# Altium schematic sheet Sheet2.SchDoc
size A4; SheetNumber: 2; SheetTotal: 3
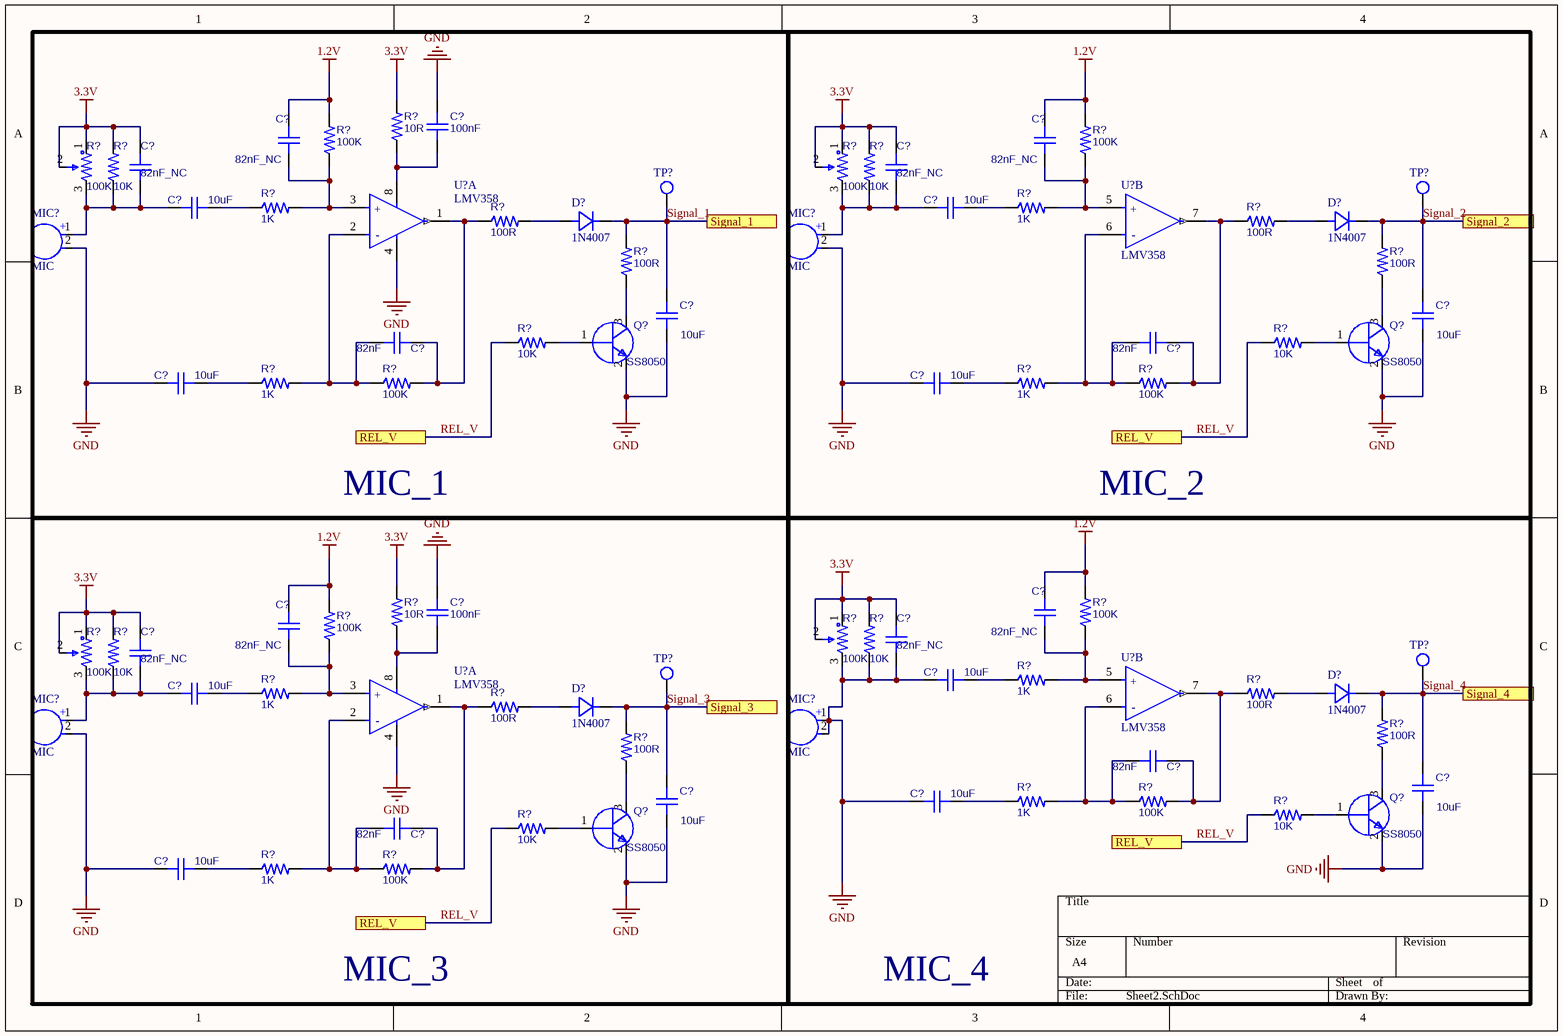
[diagram p0: Sheet2.SchDoc]

## Parts
(Parts that share a designator on the sheet are numbered #1, #2 ... from top to bottom, then left to right.)
C?#1  100nF  [CAP-SMD-0603]
C?#2  82nF_NC  [CAP-SMD-0603]
C?#3  82nF_NC  [CAP-SMD-0603]
C?#4  82nF_NC  [CAP-SMD-0603]
C?#5  82nF_NC  [CAP-SMD-0603]
C?#6  10uF  [CAP-SMD-0603]
C?#7  10uF  [CAP-SMD-0603]
C?#8  10uF  [CAP-SMD-0603]
C?#9  10uF  [CAP-SMD-0603]
C?#10  82nF  [CAP-SMD-0603]
C?#11  82nF  [CAP-SMD-0603]
C?#12  10uF  [CAP-SMD-0603]
C?#13  10uF  [CAP-SMD-0603]
C?#14  100nF  [CAP-SMD-0603]
C?#15  82nF_NC  [CAP-SMD-0603]
C?#16  82nF_NC  [CAP-SMD-0603]
C?#17  82nF_NC  [CAP-SMD-0603]
C?#18  82nF_NC  [CAP-SMD-0603]
C?#19  10uF  [CAP-SMD-0603]
C?#20  10uF  [CAP-SMD-0603]
C?#21  82nF  [CAP-SMD-0603]
C?#22  10uF  [CAP-SMD-0603]
C?#23  10uF  [CAP-SMD-0603]
C?#24  10uF  [CAP-SMD-0603]
C?#25  82nF  [CAP-SMD-0603]
C?#26  10uF  [CAP-SMD-0603]
D?#1  1N4007  [SOD-123-P3.4]
D?#2  1N4007  [SOD-123-P3.4]
D?#3  1N4007  [SOD-123-P3.4]
D?#4  1N4007  [SOD-123-P3.4]
MIC?#1  MIC  [MIC-TH-BD4.0-P1.4]
MIC?#2  MIC  [MIC-TH-BD4.0-P1.4]
MIC?#3  MIC  [MIC-TH-BD4.0-P1.4]
MIC?#4  MIC  [MIC-TH-BD4.0-P1.4]
Q?#1  SS8050  [SOT-23-3-LP2.28-P1.91]
Q?#2  SS8050  [SOT-23-3-LP2.28-P1.91]
Q?#3  SS8050  [SOT-23-3-LP2.28-P1.91]
Q?#4  SS8050  [SOT-23-3-LP2.28-P1.91]
R?#1  10R  [RES-SMD-0603]
R?#2  100K  [RES-SMD-0603]
R?#3  100K  [RES-SMD-0603]
R?#4  100K  [RES-SMD-ADJ-3224W]
R?#5  10K  [RES-SMD-0603]
R?#6  100K  [RES-SMD-ADJ-3224W]
R?#7  10K  [RES-SMD-0603]
R?#8  1K  [RES-SMD-0603]
R?#9  1K  [RES-SMD-0603]
R?#10  100R  [RES-SMD-0603]
R?#11  100R  [RES-SMD-0603]
R?#12  100R  [RES-SMD-0603]
R?#13  100R  [RES-SMD-0603]
R?#14  10K  [RES-SMD-0603]
R?#15  10K  [RES-SMD-0603]
R?#16  1K  [RES-SMD-0603]
R?#17  100K  [RES-SMD-0603]
R?#18  1K  [RES-SMD-0603]
R?#19  100K  [RES-SMD-0603]
R?#20  10R  [RES-SMD-0603]
R?#21  100K  [RES-SMD-0603]
R?#22  100K  [RES-SMD-0603]
R?#23  100K  [RES-SMD-ADJ-3224W]
R?#24  10K  [RES-SMD-0603]
R?#25  100K  [RES-SMD-ADJ-3224W]
R?#26  10K  [RES-SMD-0603]
R?#27  1K  [RES-SMD-0603]
R?#28  1K  [RES-SMD-0603]
R?#29  100R  [RES-SMD-0603]
R?#30  100R  [RES-SMD-0603]
R?#31  100R  [RES-SMD-0603]
R?#32  100R  [RES-SMD-0603]
R?#33  1K  [RES-SMD-0603]
R?#34  100K  [RES-SMD-0603]
R?#35  10K  [RES-SMD-0603]
R?#36  10K  [RES-SMD-0603]
R?#37  1K  [RES-SMD-0603]
R?#38  100K  [RES-SMD-0603]
TP?#1  TP  [TP]  (value not drawn)
TP?#2  TP  [TP]  (value not drawn)
TP?#3  TP  [TP]  (value not drawn)
TP?#4  TP  [TP]  (value not drawn)
U?#1  LMV358  [SOIC-8-LP5.5-P1.27]  (part A of 2)
U?#2  LMV358  [SOIC-8-LP5.5-P1.27]  (part B of 2)
U?#3  LMV358  [SOIC-8-LP5.5-P1.27]  (part B of 2)
U?#4  LMV358  [SOIC-8-LP5.5-P1.27]  (part A of 2)

## Blocks framed on the sheet
MIC_1: C?#1 C?#2 C?#4 C?#6 C?#8 C?#10 C?#12 D?#1 MIC?#1 Q?#1 R?#1 R?#2 R?#4 R?#5 R?#8 R?#10 R?#12 R?#14 R?#16 R?#17 TP?#1 U?#1
MIC_2: C?#3 C?#5 C?#7 C?#9 C?#11 C?#13 D?#2 MIC?#2 Q?#2 R?#3 R?#6 R?#7 R?#9 R?#11 R?#13 R?#15 R?#18 R?#19 TP?#2 U?#2
MIC_3: C?#14 C?#16 C?#18 C?#20 C?#23 C?#25 C?#26 D?#4 MIC?#3 Q?#4 R?#20 R?#22 R?#25 R?#26 R?#28 R?#30 R?#32 R?#36-R?#38 TP?#4 U?#4
MIC_4: C?#15 C?#17 C?#19 C?#21 C?#22 C?#24 D?#3 MIC?#4 Q?#3 R?#21 R?#23 R?#24 R?#27 R?#29 R?#31 R?#33-R?#35 TP?#3 U?#3

## Ports
REL_V (see Sheet2[1B], Sheet2[1D], Sheet2[3B]), REL_V (see Sheet2[1B], Sheet2[1D], Sheet2[3D]), REL_V (see Sheet2[1B], Sheet2[3B], Sheet2[3D]), REL_V (see Sheet2[1D], Sheet2[3B], Sheet2[3D]), Signal_1, Signal_2, Signal_3, Signal_4

## Nets
1.2V: C?#2.2 C?#3.2 C?#15.2 C?#16.2 R?#2.2 R?#3.2 R?#21.2 R?#22.2
3.3V: C?#4.2 C?#5.2 C?#17.2 C?#18.2 R?#1.2 R?#4.1 R?#4.2 R?#5.2 R?#6.1 R?#6.2 R?#7.2 R?#20.2 R?#23.1 R?#23.2 R?#24.2 R?#25.1 R?#25.2 R?#26.2
GND: C?#1.2 C?#8.1 C?#9.1 C?#12.1 C?#13.1 C?#14.2 C?#17.1 C?#19.1 C?#22.1 C?#23.1 C?#24.1 C?#26.1 MIC?#1.2(C) MIC?#2.2(C) MIC?#3.2(C) MIC?#4.1(A) MIC?#4.2(C) Q?#1.2(E) Q?#2.2(E) Q?#3.2(E) Q?#4.2(E) R?#23.3 R?#24.1 U?#1.4(GND) U?#4.4(GND)
REL_V: R?#14.1 R?#15.1 R?#35.1 R?#36.1 ; port REL_V
Signal_1: C?#8.2 D?#1.2(A) R?#12.2 TP?#1.1 ; port Signal_1
Signal_2: C?#9.2 D?#2.2(A) R?#13.2 TP?#2.1 ; port Signal_2
Signal_3: C?#23.2 D?#4.2(A) R?#32.2 TP?#4.1 ; port Signal_3
Signal_4: C?#22.2 D?#3.2(A) R?#31.2 TP?#3.1 ; port Signal_4
NetC?#1_1: C?#1.1 R?#1.1 U?#1.8(VCC+)
NetC?#2_1: C?#2.1 R?#2.1 R?#8.2 U?#1.3(1IN+)
NetC?#3_1: C?#3.1 R?#3.1 R?#9.2 U?#2.5(1IN+)
NetC?#4_1: C?#4.1 C?#6.1 MIC?#1.1(A) R?#4.3 R?#5.1
NetC?#5_1: C?#5.1 C?#7.1 MIC?#2.1(A) R?#6.3 R?#7.1
NetC?#6_2: C?#6.2 R?#8.1
NetC?#7_2: C?#7.2 R?#9.1
NetC?#10_1: C?#10.1 R?#16.2 R?#17.1 U?#1.2(1IN-)
NetC?#10_2: C?#10.2 R?#10.1 R?#17.2 U?#1.1(OUT)
NetC?#11_1: C?#11.1 R?#18.2 R?#19.1 U?#2.6(1IN-)
NetC?#11_2: C?#11.2 R?#11.1 R?#19.2 U?#2.7(OUT)
NetC?#12_2: C?#12.2 R?#16.1
NetC?#13_2: C?#13.2 R?#18.1
NetC?#14_1: C?#14.1 R?#20.1 U?#4.8(VCC+)
NetC?#15_1: C?#15.1 R?#21.1 R?#27.2 U?#3.5(1IN+)
NetC?#16_1: C?#16.1 R?#22.1 R?#28.2 U?#4.3(1IN+)
NetC?#18_1: C?#18.1 C?#20.1 MIC?#3.1(A) R?#25.3 R?#26.1
NetC?#19_2: C?#19.2 R?#27.1
NetC?#20_2: C?#20.2 R?#28.1
NetC?#21_1: C?#21.1 R?#33.2 R?#34.1 U?#3.6(1IN-)
NetC?#21_2: C?#21.2 R?#29.1 R?#34.2 U?#3.7(OUT)
NetC?#24_2: C?#24.2 R?#33.1
NetC?#25_1: C?#25.1 R?#37.2 R?#38.1 U?#4.2(1IN-)
NetC?#25_2: C?#25.2 R?#30.1 R?#38.2 U?#4.1(OUT)
NetC?#26_2: C?#26.2 R?#37.1
NetD?#1_1: D?#1.1(K) R?#10.2
NetD?#2_1: D?#2.1(K) R?#11.2
NetD?#3_1: D?#3.1(K) R?#29.2
NetD?#4_1: D?#4.1(K) R?#30.2
NetQ?#1_1: Q?#1.1(B) R?#14.2
NetQ?#1_3: Q?#1.3(C) R?#12.1
NetQ?#2_1: Q?#2.1(B) R?#15.2
NetQ?#2_3: Q?#2.3(C) R?#13.1
NetQ?#3_1: Q?#3.1(B) R?#35.2
NetQ?#3_3: Q?#3.3(C) R?#31.1
NetQ?#4_1: Q?#4.1(B) R?#36.2
NetQ?#4_3: Q?#4.3(C) R?#32.1

## Notes on the sheet
- (in symbol LMV358, part A) +; -
- (in symbol LMV358, part B) +; -
- (in symbol MIC) +

## Library data of the parts
C?#1-C?#26 = CAP: 贴片电容; BOM_Manufacturer: SAMSUNG; BOM_Manufacturer Part: CL03A104KQ3NNNC; nameAlias: Capacitance; Contributor: LCSC; BOM_Supplier: LCSC; BOM_Supplier Part: C160831; BOM_JLCPCB Part Class: Extended Part; spicePre: C; spiceSymbolName: CL03A104KQ3NNNC
D?#1-D?#4 = Diode: 二极管1N4148W; Manufacturer: PSI(宝力芯); Symbol: 1N4148W_C2840890; Add into BOM: yes; Power Dissipation: 350mW; Reverse Voltage (Vr): 100V; Average Rectified Current (Io): 150mA; Forward Voltage (Vf@If): 1.25V@150mA; Reverse Leakage Current: 1A@75V; Reverse Recovery Time (trr): 4ns; Device: 1N4148W; LCSC Part Name: 100V 150mA 4ns; Supplier Part: C2840890; Manufacturer Part: 1N4148W; Supplier Footprint: SOD-123; JLCPCB Part Class: Extended Part; Datasheet: https://atta.szlcsc.com/upload/public/pdf/source/20210709/C2840890_3AF002B6505A4091F26B54E36362ABEF.pdf; Supplier: LCSC; Convert to PCB: yes; Diode Configuration: -; Operating Temperature: +150@(Tj)
MIC?#1-MIC?#4 = MIC: 咪头MIC COND ANALOG OMNI -38DB
Q?#1-Q?#4 = NPN-SOT-23-3: 贴片NPN三极管; BOM_Manufacturer: YFW佑风微; BOM_Manufacturer Part: S9013; Contributor: LCSC; BOM_Supplier: LCSC; BOM_Supplier Part: C2898668; BOM_JLCPCB Part Class: Extended Part; spicePre: Q; spiceSymbolName: S9013_C2898668
R?#1 R?#5 R?#7-R?#16 R?#18 R?#20 R?#24 R?#26-R?#33 R?#35-R?#37 = RES: 贴片电阻; BOM_Manufacturer: Chengdu Guosheng Tech; BOM_Manufacturer Part: 3362P-1-104; Resistance(Ohms): 100K; nameAlias: Resistance; Contributor: LCSC; BOM_Supplier: LCSC; BOM_Supplier Part: C118966; Resistance (Ohms): 100K; BOM_JLCPCB Part Class: Extended Part; spicePre: R; spiceSymbolName: 3362P-1-104_C118966
R?#2 R?#3 R?#17 R?#19 R?#21 R?#22 R?#34 R?#38 = RES: 贴片电阻; BOM_Manufacturer: Chengdu Guosheng Tech; BOM_Manufacturer Part: 3362P-1-104; nameAlias: Resistance; Contributor: LCSC; BOM_Supplier: LCSC; BOM_Supplier Part: C118966; Resistance(Ohms): 100K; Resistance (Ohms): 100K; BOM_JLCPCB Part Class: Extended Part; spicePre: R; spiceSymbolName: 3362P-1-104_C118966
R?#4 R?#6 R?#23 R?#25 = RES-ADJ: 可调电阻,电位器; BOM_Manufacturer: Chengdu Guosheng Tech; BOM_Manufacturer Part: 3362P-1-104; nameAlias: Resistance; Contributor: LCSC; BOM_Supplier: LCSC; BOM_Supplier Part: C118966; Resistance(Ohms): 100K; Resistance (Ohms): 100K; BOM_JLCPCB Part Class: Extended Part; spicePre: R; spiceSymbolName: 3362P-1-104_C118966
TP?#1-TP?#4 = TP: TP测试点
U?#1-U?#4 = LMV358: 运放IC OPAMP GP 2 CIRCUIT 8SOIC